# EAGLE design wachcio_meteo (EAGLE 7.7.0)

## Sheet 1 of 3: urzadzenie
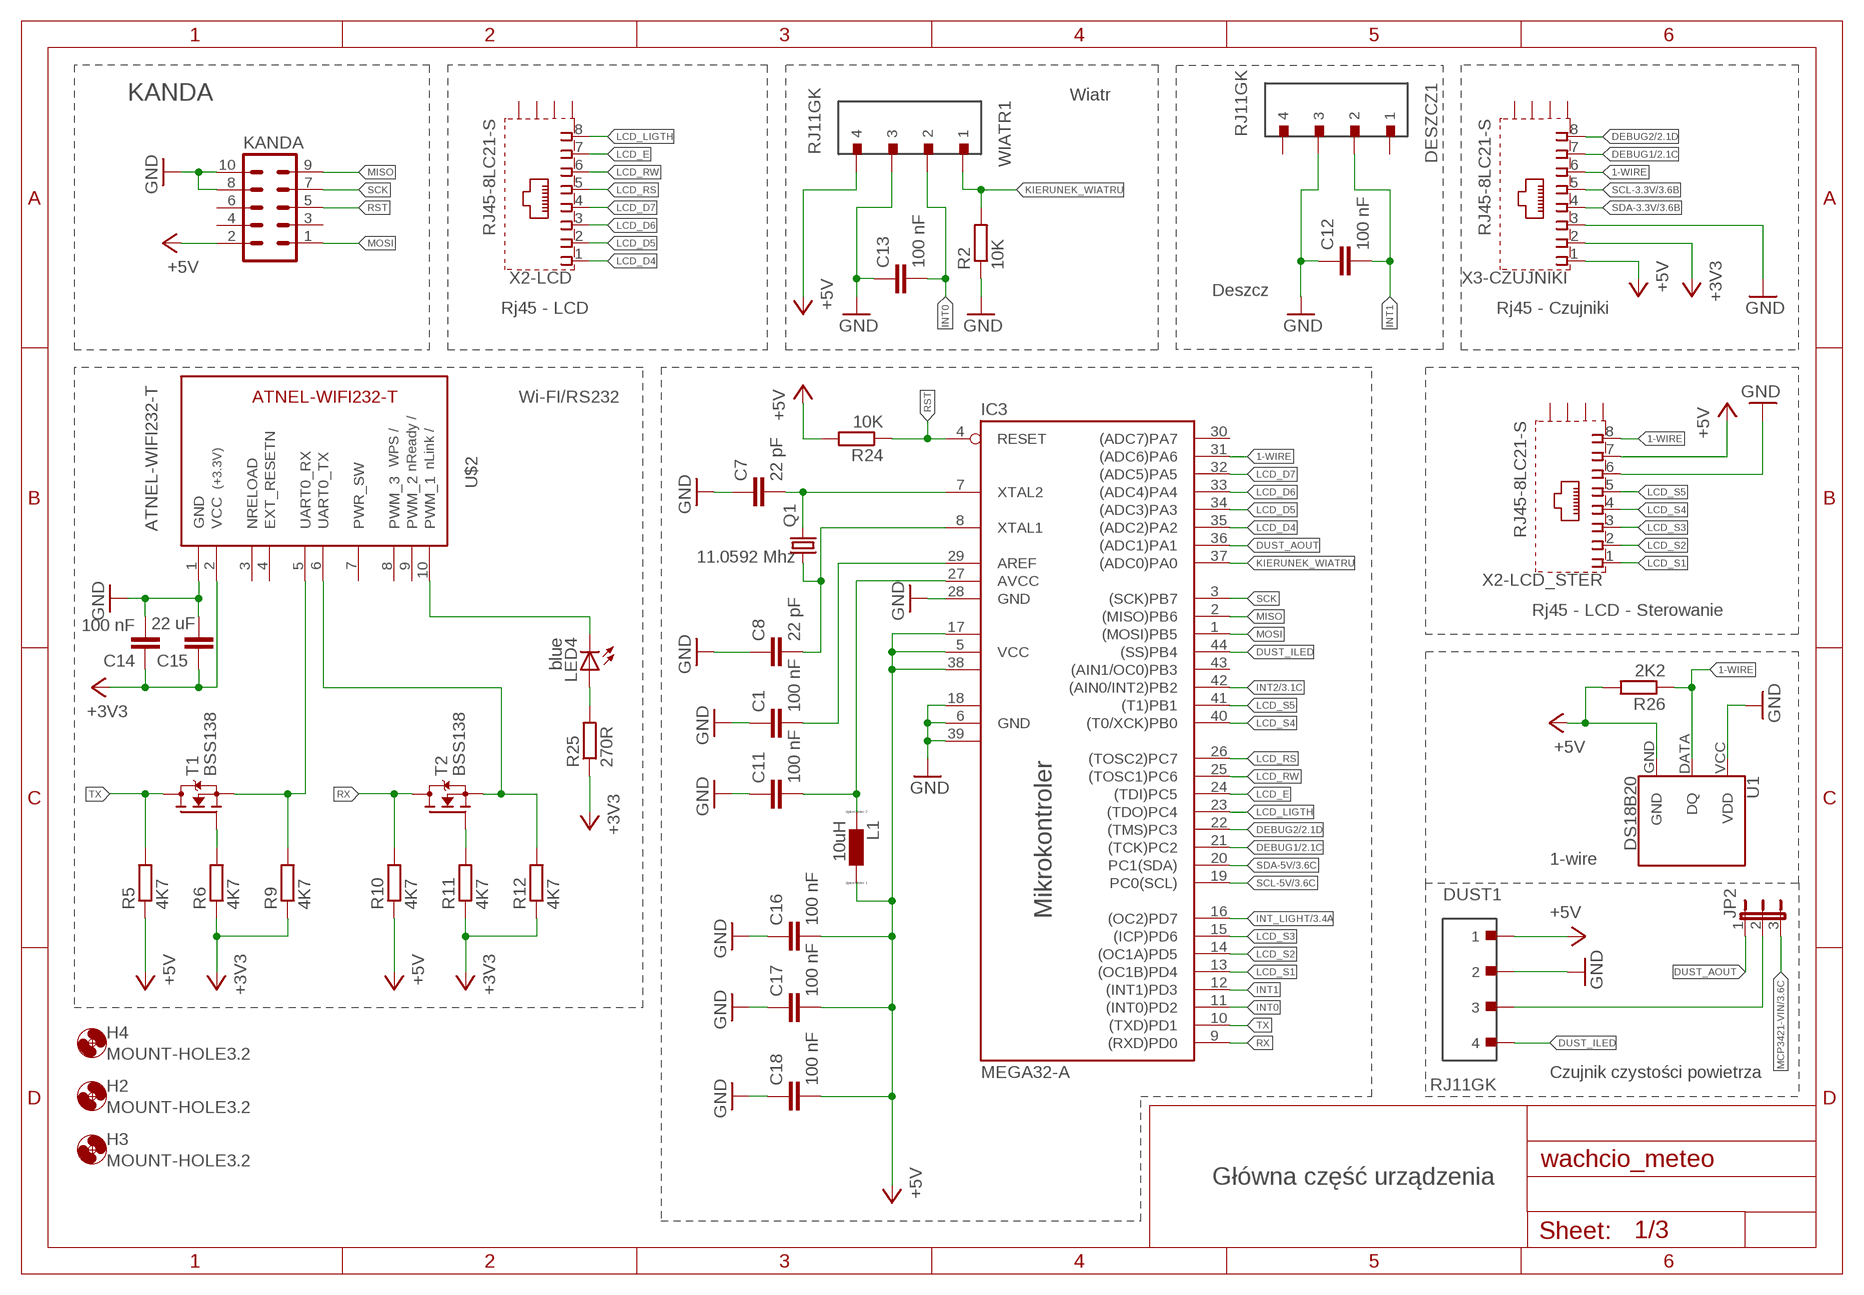
[diagram p0: schematic, sheet 1]

### Parts
C1  100 nF  C-EUC0805  [C0805]
C7  22 pF  C-EUC0805  [C0805]
C8  22 pF  C-EUC0805  [C0805]
C11  100 nF  C-EUC0805  [C0805]
C12  100 nF  C-EUC0805  [C0805]
C13  100 nF  C-EUC0805  [C0805]
C14  100 nF  C-EUC0805  [C0805]
C15  22 uF  C-EUC0805  [C0805]
C16  100 nF  C-EUC0805  [C0805]
C17  100 nF  C-EUC0805  [C0805]
C18  100 nF  C-EUC0805  [C0805]
DESZCZ1  RJ11GK  [RJ11GK]
DUST1  RJ11GK  [RJ11GK]
H2  MOUNT-HOLE3.2  [3,2]
H3  MOUNT-HOLE3.2  [3,2]
H4  MOUNT-HOLE3.2  [3,2]
IC3  MEGA32-A  [TQFP44]
JP2  JP2E  [JP2]
KANDA  ML10  [ML10]
L1  10uH  LL3230M  [L3230M]
LED4  blue  LEDCHIPLED_1206  [CHIPLED_1206]
Q1  11.0592 Mhz  CRYSTALSM49  [SM49]
R2  10K  R-EU_M0805  [M0805]
R5  4K7  R-EU_M0805  [M0805]
R6  4K7  R-EU_M0805  [M0805]
R9  4K7  R-EU_M0805  [M0805]
R10  4K7  R-EU_M0805  [M0805]
R11  4K7  R-EU_M0805  [M0805]
R12  4K7  R-EU_M0805  [M0805]
R24  10K  R-EU_M0805  [M0805]
R25  270R  R-EU_M0805  [M0805]
R26  2K2  R-EU_M0805  [M0805]
T1  BSS138  MOSFET-N-SOT23  [SOT23]
T2  BSS138  MOSFET-N-SOT23  [SOT23]
U1  DS18B20  [TO-92-AMMO]
U$2  ATNEL-WIFI232-T  [ATNEL-WIFI232-T]
WIATR1  RJ11GK  [RJ11GK]
X2-LCD  RJ45-8LC21-S  [RJ45-SHIELD1]
X2-LCD_STER  RJ45-8LC21-S  [RJ45-SHIELD1]
X3-CZUJNIKI  RJ45-8LC21-S  [RJ45-SHIELD1]

### Nets
1-WIRE: IC3.31((ADC6)PA6) R26.1 U1.DATA(DQ) X2-LCD_STER.8 X3-CZUJNIKI.6
+3V3: C14.1 C15.1 R6.1 R9.1 R11.1 R12.1 R25.1 U$2.2(VCC) X3-CZUJNIKI.2 ; also sheet 2,3
+5V: C16.2 C17.2 C18.2 DUST1.1 IC3.5(VCC) IC3.17(VCC1) IC3.38(VCC2) KANDA.2 L1.1 R5.1 R10.1 R24.2 R26.2 U1.GND WIATR1.4 X2-LCD_STER.7 X3-CZUJNIKI.1 ; also sheet 2,3
DEBUG1: IC3.21((TCK)PC2) X3-CZUJNIKI.7 ; also sheet 2
DEBUG2: IC3.22((TMS)PC3) X3-CZUJNIKI.8 ; also sheet 2
DUST_AOUT: IC3.36((ADC1)PA1) JP2.1
DUST_ILED: DUST1.4 IC3.44((SS)PB4)
GND: C1.1 C7.1 C8.1 C11.1 C12.1 C13.1 C14.2 C15.2 C16.1 C17.1 C18.1 DESZCZ1.3 DUST1.2 IC3.6(GND) IC3.18(GND1) IC3.28(GND) IC3.39(GND2) KANDA.8 KANDA.10 R2.1 U1.VCC(VDD) U$2.1(GND) WIATR1.3 X2-LCD_STER.6 X3-CZUJNIKI.3 ; also sheet 2,3
INT0: C13.2 IC3.11((INT0)PD2) WIATR1.2
INT1: C12.2 DESZCZ1.2 IC3.12((INT1)PD3)
INT2: IC3.42((AIN0/INT2)PB2) ; also sheet 3
INT_LIGHT: IC3.16((OC2)PD7) ; also sheet 3
KIERUNEK_WIATRU: IC3.37((ADC0)PA0) R2.2 WIATR1.1
LCD_D4: IC3.35((ADC2)PA2) X2-LCD.1
LCD_D5: IC3.34((ADC3)PA3) X2-LCD.2
LCD_D6: IC3.33((ADC4)PA4) X2-LCD.3
LCD_D7: IC3.32((ADC5)PA5) X2-LCD.4
LCD_E: IC3.24((TDI)PC5) X2-LCD.7
LCD_LIGTH: IC3.23((TDO)PC4) X2-LCD.8
LCD_RS: IC3.26((TOSC2)PC7) X2-LCD.5
LCD_RW: IC3.25((TOSC1)PC6) X2-LCD.6
LCD_S1: IC3.13((OC1B)PD4) X2-LCD_STER.1
LCD_S2: IC3.14((OC1A)PD5) X2-LCD_STER.2
LCD_S3: IC3.15((ICP)PD6) X2-LCD_STER.3
LCD_S4: IC3.40((T0/XCK)PB0) X2-LCD_STER.4
LCD_S5: IC3.41((T1)PB1) X2-LCD_STER.5
MCP3421-VIN: JP2.3 ; also sheet 3
MISO: IC3.2((MISO)PB6) KANDA.9
MOSI: IC3.1((MOSI)PB5) KANDA.1
N$1: R9.2 T1.2(S) U$2.5(UART0_RX)
N$2: C11.2 IC3.27(AVCC) L1.2
N$3: C1.2 IC3.29(AREF)
N$5: LED4.A R25.2
N$6: R6.2 T1.1(G)
N$8: LED4.C U$2.10(PWM_1)
N$9: R12.2 T2.2(S) U$2.6(UART0_TX)
N$10: C7.2 IC3.7(XTAL2) Q1.2
N$11: C8.2 IC3.8(XTAL1) Q1.1
N$16: DUST1.3 JP2.2
N$22: R11.2 T2.1(G)
RST: IC3.4(RESET) KANDA.5 R24.1
RX: IC3.9((RXD)PD0) R10.2 T2.3(D)
SCK: IC3.3((SCK)PB7) KANDA.7
SCL-3.3V: X3-CZUJNIKI.5 ; also sheet 3
SCL-5V: IC3.19(PC0(SCL)) ; also sheet 3
SDA-3.3V: X3-CZUJNIKI.4 ; also sheet 3
SDA-5V: IC3.20(PC1(SDA)) ; also sheet 3
TX: IC3.10((TXD)PD1) R5.2 T1.3(D)
Unconnected: DESZCZ1.1 DESZCZ1.4 IC3.30((ADC7)PA7) IC3.43((AIN1/OC0)PB3) KANDA.3 KANDA.4 KANDA.6 U$2.3(NRELOAD) U$2.4(EXT_RESETN) U$2.7(PWR_SW) U$2.8(PWM_3) U$2.9(PWM_2) X2-LCD.S1(S) X2-LCD.S2(S) X2-LCD.S3(S) X2-LCD.S4(S) X2-LCD_STER.S1(S) X2-LCD_STER.S2(S) X2-LCD_STER.S3(S) X2-LCD_STER.S4(S) X3-CZUJNIKI.S1(S) X3-CZUJNIKI.S2(S) X3-CZUJNIKI.S3(S) X3-CZUJNIKI.S4(S)

### Notes on the sheet
- KANDA | Wiatr
- Deszcz
- Rj45 - LCD | Rj45 - Czujniki
- Wi-FI/RS232
- Rj45 - LCD - Sterowanie
- 1-wire
- Mikrokontroler
- Czujnik czystości powietrza
- Główna część urządzenia

## Sheet 2 of 3: zasilanie
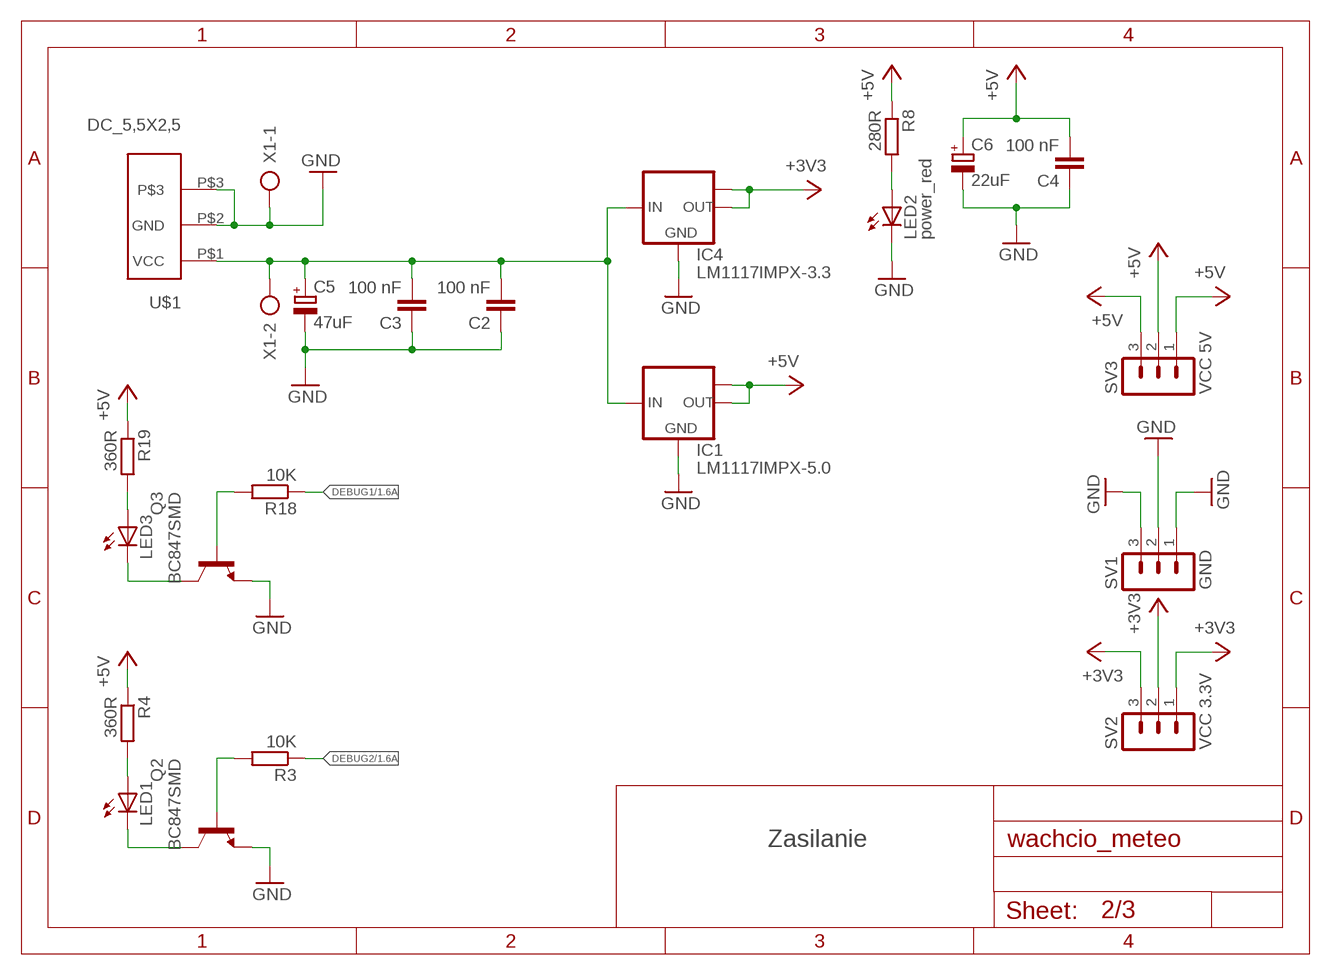
[diagram p1: schematic, sheet 2]

### Parts
C2  100 nF  C-EUC0805  [C0805]
C3  100 nF  C-EUC0805  [C0805]
C4  100 nF  C-EUC0805  [C0805]
C5  47uF  CPOL-EUB45181A  [B45181A]
C6  22uF  CPOL-EUB45181A  [B45181A]
IC1  LM1117IMPX-5.0  [SOT223]
IC4  LM1117IMPX-3.3  [SOT223]
LED1  LED3MM  [LED3MM]
LED2  power_red  LEDCHIPLED_1206  [CHIPLED_1206]
LED3  LED3MM  [LED3MM]
Q2  BC847SMD  [SOT23]
Q3  BC847SMD  [SOT23]
R3  10K  R-EU_M0805  [M0805]
R4  360R  R-EU_M0805  [M0805]
R8  280R  R-EU_M0805  [M0805]
R18  10K  R-EU_M0805  [M0805]
R19  360R  R-EU_M0805  [M0805]
SV1  GND  MA03-1  [MA03-1]
SV2  VCC 3.3V  MA03-1  [MA03-1]
SV3  VCC 5V  MA03-1  [MA03-1]
U$1  DC_5,5X2,5  [DC_5,5X2,5]
X1  AK500/2  [AK500/2]

### Nets
+3V3: IC4.2(OUT) IC4.TAB(OUT1) SV2.1 SV2.2 SV2.3 ; also sheet 1,3
+5V: C4.2 C6.+ IC1.2(OUT) IC1.TAB(OUT1) R4.1 R8.1 R19.1 SV3.1 SV3.2 SV3.3 ; also sheet 1,3
+9V: C2.2 C3.2 C5.+ IC1.3(IN) IC4.3(IN) U$1.P$1(VCC) X1.2
DEBUG1: R18.1 ; also sheet 1
DEBUG2: R3.1 ; also sheet 1
GND: C2.1 C3.1 C4.1 C5.- C6.- IC1.1(GND) IC4.1(GND) LED2.C Q2.2(E) Q3.2(E) SV1.1 SV1.2 SV1.3 U$1.P$2(GND) U$1.P$3 X1.1 ; also sheet 1,3
N$4: Q2.1(B) R3.2
N$12: LED2.A R8.2
N$17: LED1.K(C) Q2.3(C)
N$21: LED1.A R4.2
N$23: Q3.1(B) R18.2
N$24: LED3.K(C) Q3.3(C)
N$26: LED3.A R19.2

### Notes on the sheet
- Zasilanie

## Sheet 3 of 3: I2C
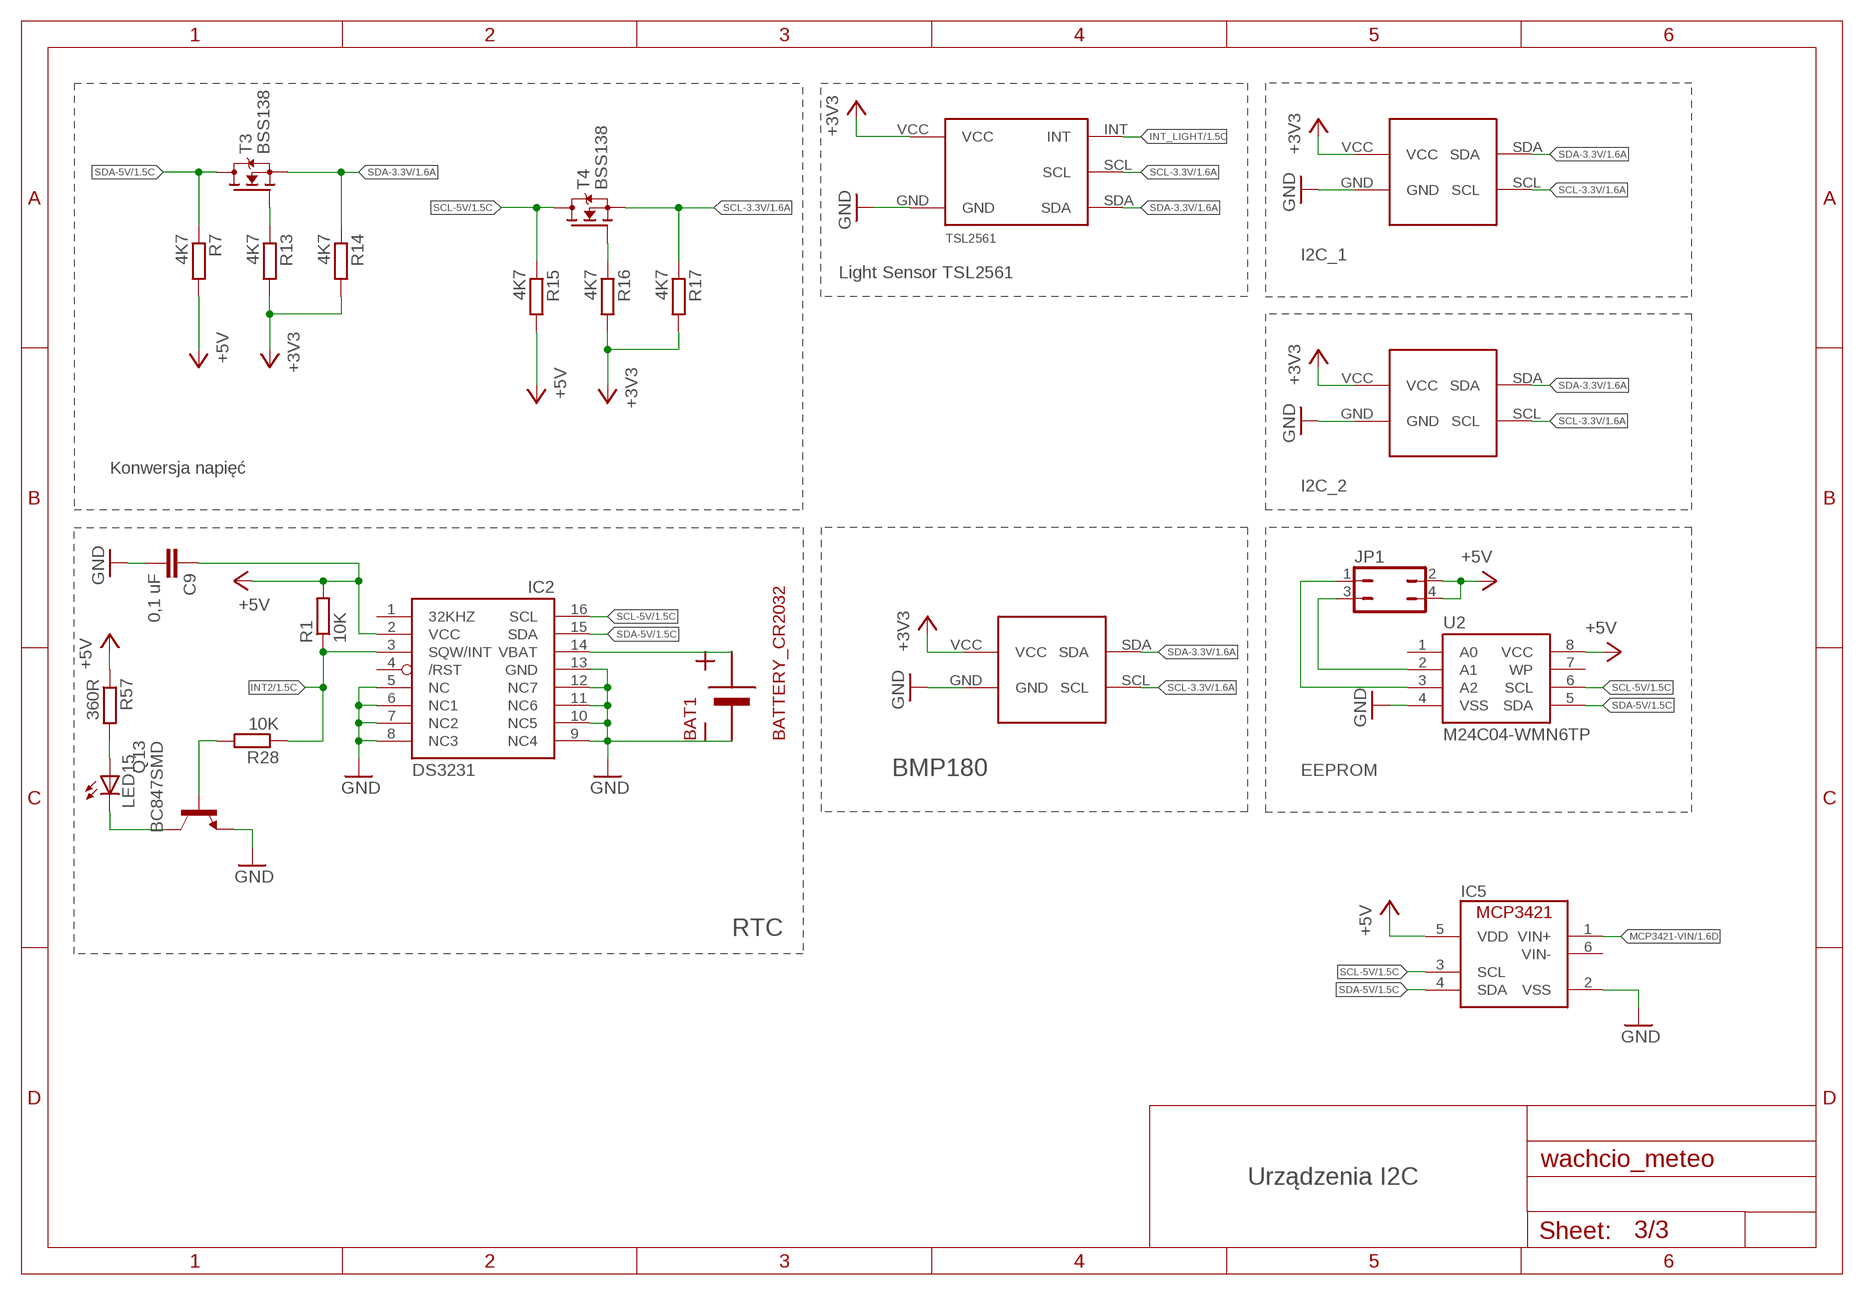
[diagram p2: schematic, sheet 3]

### Parts
BAT1  BATTERY_CR2032  [BATTERY_CR2032]
C9  0,1 uF  C-EUC0805  [C0805]
IC2  DS3231/SO  [SO16W]
IC5  MCP3421  [SOT-23]
JP1  JP2Q  [JP2Q]
LED15  LED3MM  [LED3MM]
Q13  BC847SMD  [SOT23]
R1  10K  R-EU_M0805  [M0805]
R7  4K7  R-EU_M0805  [M0805]
R13  4K7  R-EU_M0805  [M0805]
R14  4K7  R-EU_M0805  [M0805]
R15  4K7  R-EU_M0805  [M0805]
R16  4K7  R-EU_M0805  [M0805]
R17  4K7  R-EU_M0805  [M0805]
R28  10K  R-EU_M0805  [M0805]
R57  360R  R-EU_M0805  [M0805]
T3  BSS138  MOSFET-N-SOT23  [SOT23]
T4  BSS138  MOSFET-N-SOT23  [SOT23]
U2  M24C04-WMN6TP  EEPROM-I2CSMD  [SO08]
U$3  BMP180  [BMP180]
U$5  I2C_BOARD  [I2C_BOARD]
U$6  I2C_BOARD  [I2C_BOARD]
U$7  TSL2561GY-2561  [TSL2561]

### Nets
+3V3: R13.2 R14.2 R16.2 R17.2 U$3.VCC U$5.VCC U$6.VCC U$7.VCC ; also sheet 1,2
+5V: C9.1 IC2.2(VCC) IC5.5(VDD) JP1.2 JP1.4 R1.2 R7.2 R15.2 R57.1 U2.8(VCC) ; also sheet 1,2
GND: BAT1.- C9.2 IC2.5(NC) IC2.6(NC1) IC2.7(NC2) IC2.8(NC3) IC2.9(NC4) IC2.10(NC5) IC2.11(NC6) IC2.12(NC7) IC2.13(GND) IC5.2(VSS) Q13.2(E) U2.4(VSS) U$3.GND U$5.GND U$6.GND U$7.GND ; also sheet 1,2
INT2: IC2.3(SQW/INT) R1.1 R28.1 ; also sheet 1
INT_LIGHT: U$7.INT ; also sheet 1
MCP3421-VIN: IC5.1(VIN+) ; also sheet 1
N$7: BAT1.+ IC2.14(VBAT)
N$25: R13.1 T3.1(G)
N$27: R16.1 T4.1(G)
N$32: JP1.3 U2.2(A1)
N$33: JP1.1 U2.3(A2)
N$37: Q13.1(B) R28.2
N$45: LED15.K(C) Q13.3(C)
N$75: LED15.A R57.2
SCL-3.3V: R17.1 T4.2(S) U$3.SCL U$5.SCL U$6.SCL U$7.SCL ; also sheet 1
SCL-5V: IC2.16(SCL) IC5.3(SCL) R15.1 T4.3(D) U2.6(SCL) ; also sheet 1
SDA-3.3V: R14.1 T3.2(S) U$3.SDA U$5.SDA U$6.SDA U$7.SDA ; also sheet 1
SDA-5V: IC2.15(SDA) IC5.4(SDA) R7.1 T3.3(D) U2.5(SDA) ; also sheet 1
Unconnected: IC2.1(32KHZ) IC2.4(/RST) IC5.6(VIN-) U2.1(A0) U2.7(WP)

### Notes on the sheet
- I2C_1
- Light Sensor TSL2561
- Konwersja napięć
- I2C_2
- BMP180 | EEPROM
- RTC
- Urządzenia I2C

## Library data of the parts
BAT1 = wachcio:BATTERY_CR2032
C1-C4 C7-C9 C11-C18 = rcl:C-EU: CAPACITOR, European symbol
C5 C6 = rcl:CPOL-EU: POLARIZED CAPACITOR, European symbol
DESZCZ1 DUST1 WIATR1 = wachcio:RJ11GK
H2-H4 = holes:MOUNT-HOLE: MOUNTING HOLE with drill center marker
IC1 IC4 = lm1117:LM1117IMPX-*
IC2 = adafruit:DS3231
IC3 = atmel:MEGA32: MICROCONTROLLER 32 Kbytes FLASH 2 Kbytes SRAM 1 Kbytes EEPROM USART 8-channel 10 bit ADC Source: www.atmel.com .. doc2503.pdf; MPN: ATMEGA32-16AU; OC_FARNELL: 9171274; OC_NEWARK: 69K6677
IC5 = FaBo-Sensor:MCP3421
JP1 = jumper:JP2Q: JUMPER
JP2 = jumper:JP2E: JUMPER
KANDA = con-harting-ml:ML10: HARTING; OC_FARNELL: unknown; OC_NEWARK: unknown
L1 = eagle-ltspice:L: INDUCTOR, European symbol; SPICEMODEL: NONE; SPICEPREFIX: L
LED1-LED4 LED15 = adafruit:LED: LED OSRAM: - CHIPLED LG R971, LG N971, LY N971, LG Q971, LY Q971, LO R971, LY R971 LH N974, LH R974 LS Q976, LO Q976, LY Q976 LO Q996 - Hyper CHIPLED LW Q18S LB Q993, LB Q99A, LB R99A - SideLED LS A670, LO A670, LY A670, LG A670, LP A670 LB A673, LV A673, LT A673, LW A673 LH A674 LY A675 LS A676, LA A676, LO A676, LY A676, LW A676 LS A679, LY A679, LG A679 - Hyper Micro SIDELED® LS Y876, LA Y876, LO Y876, LY Y876 LT Y87S - SmartLED LW L88C, LW L88S LB L89C, LB L89S, LG L890 LS L89K, LO L89K, LY L89K LS L896, LA L896, LO L896, LY L896 - TOPLED LS T670, LO T670, LY T670, LG T670, LP T670 LSG T670, LSP T670, LSY T670, LOP T670, LYG T670 LG T671, LOG T671, LSG T671 LB T673, LV T673, LT T673, LW T673 LH T674 LS T676, LA T676, LO T676, LY T676, LB T676, LH T676, LSB T676, LW T676 LB T67C, LV T67C, LT T67C, LS T67K, LO T67K, LY T67K, LW E67C LS E67B, LA E67B, LO E67B, LY E67B, LB E67C, LV E67C, LT E67C LW T67C LS T679, LY T679, LG T679 LS T770, LO T770, LY T770, LG T770, LP T770 LB T773, LV T773, LT T773, LW T773 LH T774 LS E675, LA E675, LY E675, LS T675 LS T776, LA T776, LO T776, LY T776, LB T776 LHGB T686 LT T68C, LB T68C - Hyper Mini TOPLED® LB M676 - Mini TOPLED Santana® LG M470 LS M47K, LO M47K, LY M47K Source: http://www.osram.convergy.de/
Q1 = adafruit:CRYSTAL: CRYSTAL; OC_FARNELL: unknown; OC_NEWARK: unknown
Q2 Q3 Q13 = transistor-npn:BC847*: NPN Transistor
R1-R19 R24-R26 R28 R57 = rcl:R-EU_: RESISTOR, European symbol
SV1-SV3 = con-lstb:MA03-1: PIN HEADER; OC_FARNELL: unknown; OC_NEWARK: unknown
T1-T4 = we-transistor:MOSFET-N: N-Channel MOSFET SOT23 N-Chn MOSFET TSM3404, IRLML2502 (Vgs>=+/-20V, Vds<=20V, Id>=3A + Rds<=0.05Ohm @ Vgs=4.5V) BSS138 (Vgs>=+/-20V, Vds<=40V, Id>=0.2A + Rds<=3Ohm @ Vgs=4.5V) SOT223 Low Side Switch with Protection (Infineon) BSP76 (Vin=0...10V, Vds<=42V, Id=1.4A + Rds=0.2Ohm @ Vin=5V) BSP77 (Vin=0...10V, Vds<=42V, Id=2.2A + Rds=0.1Ohm @ Vin=5V) D²Pak Low Side Switch with Protection (Infineon) BTS117TC (Vin=0...10V, Vds<=60V, Id=3.5A + Rds=0.12Ohm @ Vin=5V) BTS133TC (Vin=0...10V, Vds<=60V, Id=7A + Rds=0.06Ohm @ Vin=5V) BTS141TC (Vin=0...10V, Vds<=60V, Id=12A + Rds=0.03Ohm @ Vin=5V) BTS3018TC (Vin=0...10V, Vds<=60V, Id=6A + Rds=0.02Ohm @ Vin=5V)
U1 = SparkFun-Sensors:DS18B20: Dallas/Maxim DS18B20 1-Wire Temperature Sensor The DS18B20 reports degrees C with 9 to 12-bit precision, -55C to 125C (+/-0.5C). Each sensor has a unique 64-Bit Serial number etched into it - allows for a huge number of sensors to be used on one data bus. Datasheet <http://datasheets.maximintegrated.com/en/ds/DS18B20.pdf> SparkFun Products One Wire Digital Temperature Sensor - DS18B20 <https://www.sparkfun.com/products/245> (SEN-00245); STORE_ID: SEN-00245
U2 = SparkFun-IC-Memory:EEPROM-I2C: I2C EEPROMs, 24LC256 and others 24LC256 Series 256 kb I2C 2 Wire (32 k x 8 Bit) 2.5 V Serial EEPROM SMD - SOIC-8 Datasheet SparkFun Products SparkFun UDB5 - PIC UAV Development Board <https://www.sparkfun.com/products/11703> (GPS-11703); PROD_ID: IC-09714; VALUE: 24LC256
U$1 = wachcio:DC_5,5X2,5
U$2 = ATNEL-WIFI232-T:ATNEL-WIFI232-T
U$3 = boards:BMP180
U$5 U$6 = boards2:I2C_BOARD
U$7 = wachcio:TSL2561
X1 = con-ptr500:AK500/2: CONNECTOR; OC_FARNELL: unknown; OC_NEWARK: unknown
X2-LCD X2-LCD_STER X3-CZUJNIKI = con-tycoelectronics:RJ45*2: RJ45 Low Profile Shield Type 2 For all RJ45 L, LC, LCT and X Series Models Source: www.tycoelectronics.com .. ENG_DS_1654001_1099_RJ_L_0507.pdf; OC_FARNELL: unknown; OC_NEWARK: unknown

## Board
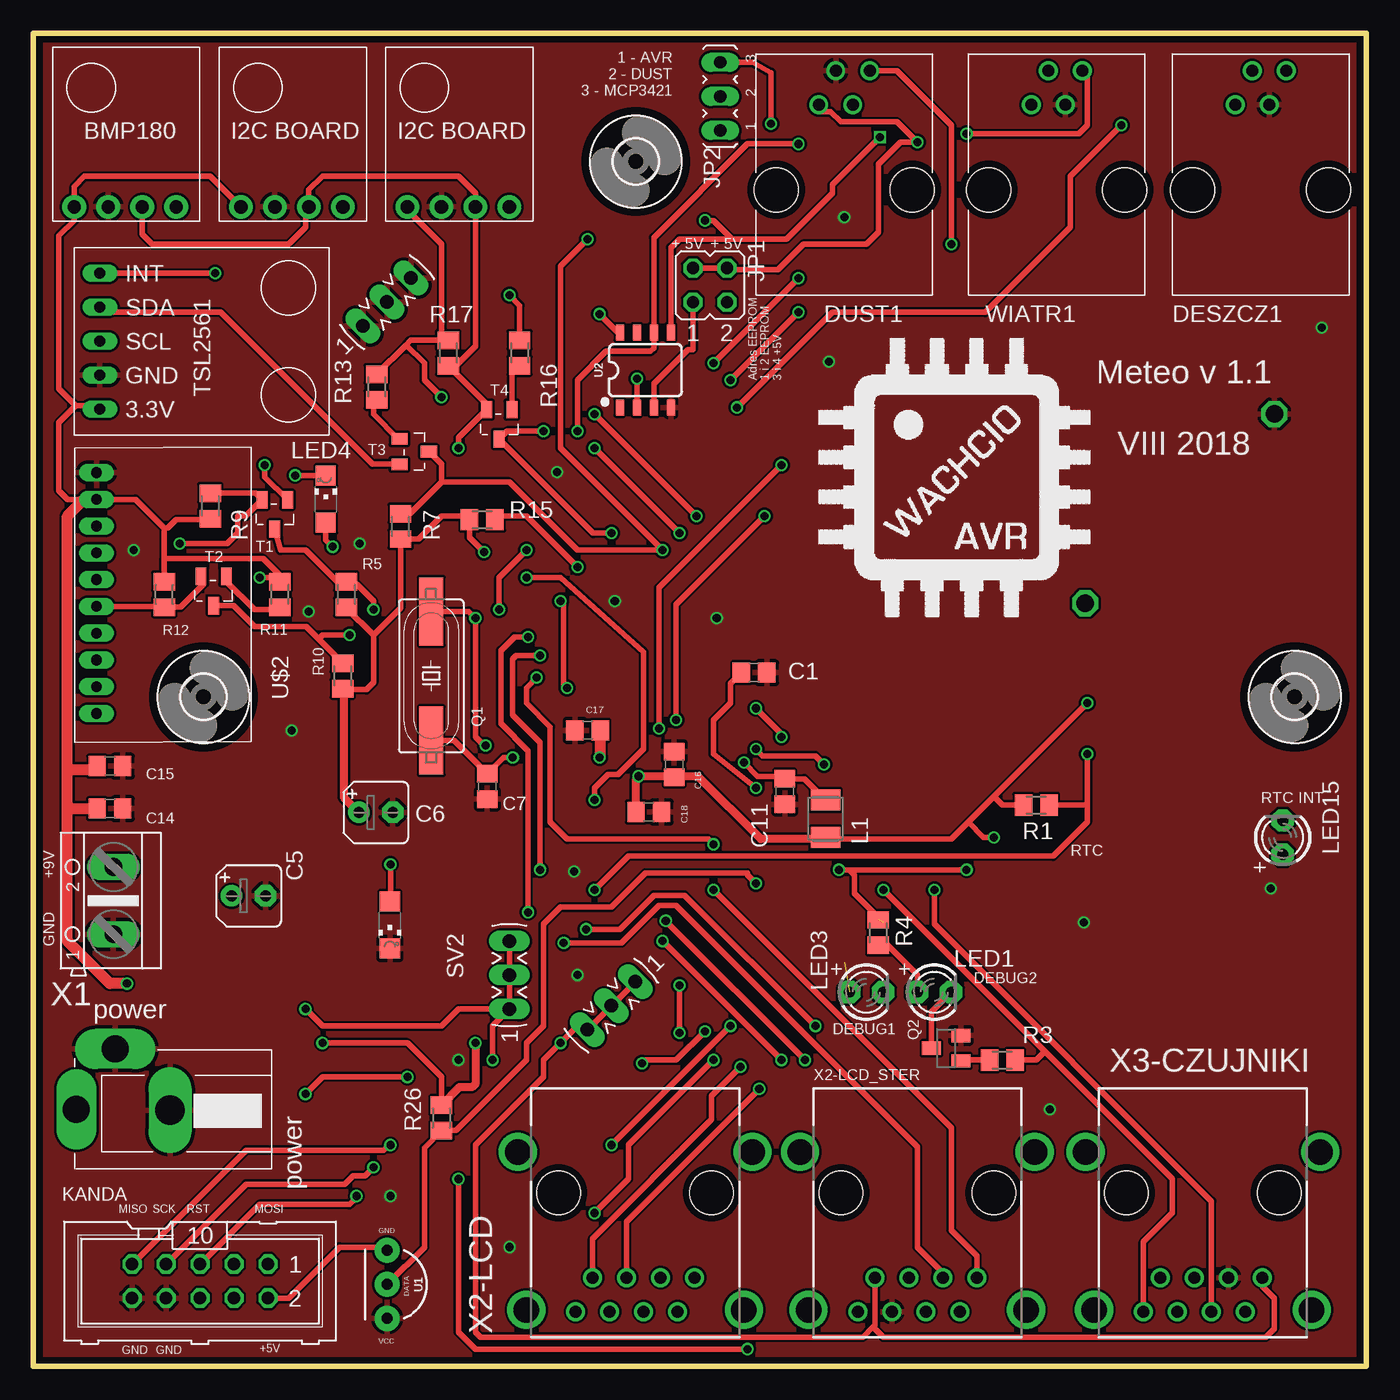
[diagram p3: board, top side]
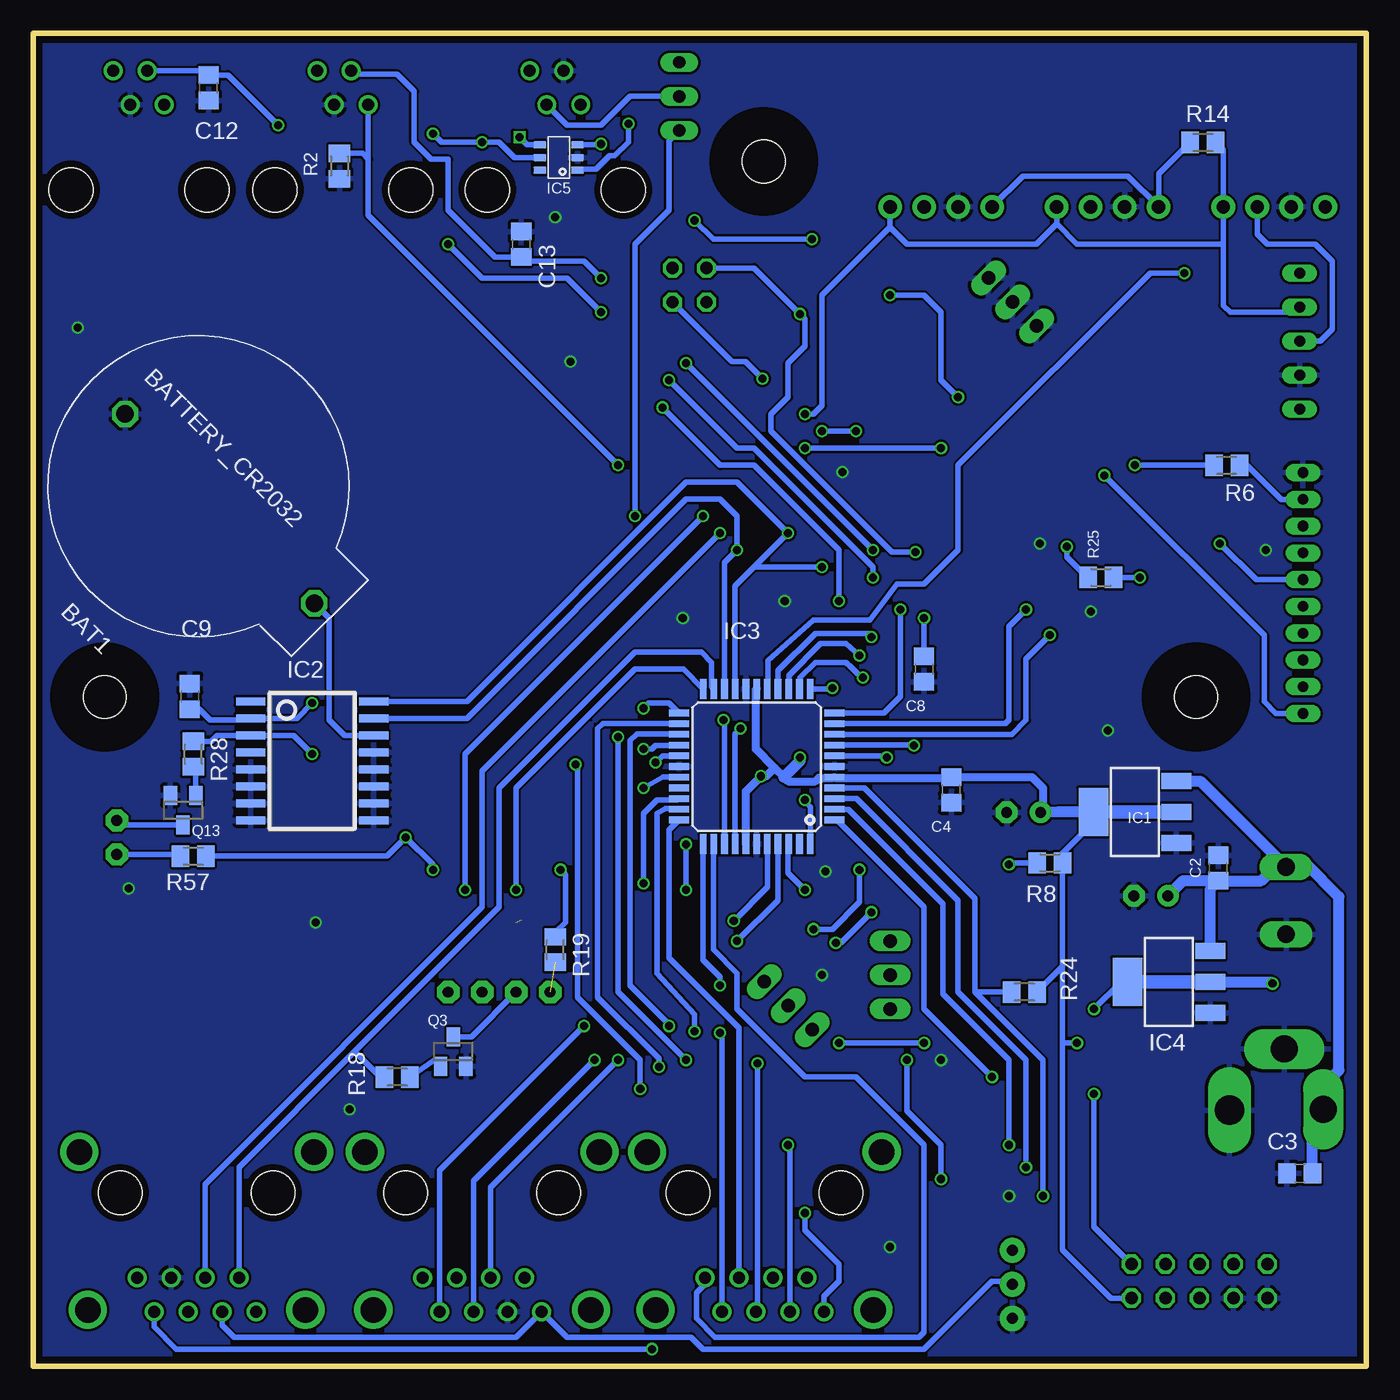
[diagram p4: board, bottom side, seen from below]

Size 99.57 x 99.57 mm. Coordinates in mm from the lower left corner, seen from the top.
Outline: 0,0 99.57,0 99.57,99.57 0,99.57 0,0
Copper layers (1*16): Top 0.035mm / dielectric 1.5mm / Bottom 0.035mm
Design rules "smart-prototyping *": minimum track width 7mil, minimum drill 12mil, track to track 7mil, track to pad 7mil, pad to pad 7mil, via to via 7mil, smd to smd 0mil, copper to edge 20mil, drill to drill 10mil, minimum pad ring 10mil, minimum via ring 6mil, stop-mask expansion 2mil, vias tented up to drill 0mil, thermal gap 10mil

### Footprints (pad centres in the part's own frame; a part is rotated, then mirrored left to right if it is on the bottom)
BATTERY_CR2032 = drill 1.3 octagon: + -11,0; - 9,0
C0805 = smd 1.3 x 1.5: 1 -0.95,0; 2 0.95,0
B45181A = drill 0.813 pad 1.6: + -1.27,0 | drill 0.813 pad 1.6 octagon: - 1.27,0
RJ11GK = drill 0.9: 1 -1.65,5.34; 2 -0.38,7.88; 3 0.89,5.34; 4 2.16,7.88 | hole 3.3: -4.83,-1.01; 5.33,-1.01
3,2 = hole 3.2: 0,0
SOT223 = smd 1.219 x 2.235: 1 -2.311,-3.099; 2 0,-3.099; 3 2.311,-3.099 | smd 3.6 x 2.2: TAB 0,3.099
SO16W = smd 0.6 x 2.2: 1 -4.445,-4.6; 2 -3.175,-4.6; 3 -1.905,-4.6; 4 -0.635,-4.6; 5 0.635,-4.6; 6 1.905,-4.6; 7 3.175,-4.6; 8 4.445,-4.6; 9 4.445,4.6; 10 3.175,4.6; 11 1.905,4.6; 12 0.635,4.6; 13 -0.635,4.6; 14 -1.905,4.6; 15 -3.175,4.6; 16 -4.445,4.6
TQFP44 = smd 1.5 x 0.5: 1 -5.8,4; 2 -5.8,3.2; 3 -5.8,2.4; 4 -5.8,1.6; 5 -5.8,0.8; 6 -5.8,0; 7 -5.8,-0.8; 8 -5.8,-1.6; 9 -5.8,-2.4; 10 -5.8,-3.2; 11 -5.8,-4; 23 5.8,-4; 24 5.8,-3.2; 25 5.8,-2.4; 26 5.8,-1.6; 27 5.8,-0.8; 28 5.8,0; 29 5.8,0.8; 30 5.8,1.6; 31 5.8,2.4; 32 5.8,3.2; 33 5.8,4 | smd 0.5 x 1.5: 12 -4,-5.8; 13 -3.2,-5.8; 14 -2.4,-5.8; 15 -1.6,-5.8; 16 -0.8,-5.8; 17 0,-5.8; 18 0.8,-5.8; 19 1.6,-5.8; 20 2.4,-5.8; 21 3.2,-5.8; 22 4,-5.8; 34 4,5.8; 35 3.2,5.8; 36 2.4,5.8; 37 1.6,5.8; 38 0.8,5.8; 39 0,5.8; 40 -0.8,5.8; 41 -1.6,5.8; 42 -2.4,5.8; 43 -3.2,5.8; 44 -4,5.8
SOT-23 = smd 1 x 0.55: 1 -1.4,0.95; 2 -1.4,0; 3 -1.4,-0.95; 4 1.4,-0.95; 5 1.4,0; 6 1.4,0.95
JP2Q = drill 0.914 octagon: 1 -1.27,-1.27; 2 -1.27,1.27; 3 1.27,-1.27; 4 1.27,1.27
JP2 = drill 0.914 long: 1 -2.54,0; 2 0,0; 3 2.54,0
ML10 = drill 0.914 octagon: 1 -5.08,-1.27; 2 -5.08,1.27; 3 -2.54,-1.27; 4 -2.54,1.27; 5 0,-1.27; 6 0,1.27; 7 2.54,-1.27; 8 2.54,1.27; 9 5.08,-1.27; 10 5.08,1.27
L3230M = smd 1.6 x 2.2: 1 -1.4,0; 2 1.4,0
LED3MM = drill 0.813 pad 1.676 octagon: A -1.27,0; K 1.27,0
CHIPLED_1206 = smd 1.5 x 1.5: A 0,-1.75; C 0,1.75
SM49 = smd 5.08 x 1.778: 1 -4.826,0; 2 4.826,0
SOT23 = smd 1 x 1.4: 1 -0.95,-1.1; 2 0.95,-1.1; 3 0,1.1
M0805 = smd 1.3 x 1.6: 1 -0.95,0; 2 0.95,0
MA03-1 = drill 1.016 long: 1 -2.54,0; 2 0,0; 3 2.54,0
SOT23' = smd 1.3 x 0.9: 1 -1.1,0.95; 2 -1.1,-0.95; 3 1.1,0
TO-92-AMMO = drill 0.813 pad 1.88: DATA 0,0; GND -2.54,0; VCC 2.54,0
SO08 = smd 0.6 x 1.2: 1 -1.905,-2.8; 2 -0.635,-2.8; 3 0.635,-2.8; 4 1.905,-2.8; 5 1.905,2.8; 6 0.635,2.8; 7 -0.635,2.8; 8 -1.905,2.8
DC_5,5X2,5 = drill 2 long: P$1 14.605,4.445; P$2 11.7,-0.07 | drill 2.2 long: P$3 7.6,4.5
ATNEL-WIFI232-T = drill 0.8 pad 1.27 long: 1 -9.1,-5.45; 2 -7.1,-5.45; 3 -5.1,-5.45; 4 -3.1,-5.45; 5 -1.1,-5.45; 6 0.9,-5.45; 7 2.9,-5.45; 8 4.9,-5.45; 9 6.9,-5.45; 10 8.9,-5.45
BMP180 = drill 1 pad 1.778: GND 1.27,5.08; SCL -1.27,5.08; SDA -3.81,5.08; VCC 3.81,5.08
I2C_BOARD = drill 1 pad 1.778: GND 1.27,5.08; SCL -1.27,5.08; SDA -3.81,5.08; VCC 3.81,5.08
TSL2561 = drill 0.8 long: GND 3.175,-8.255; INT -4.445,-8.255; SCL 0.635,-8.255; SDA -1.905,-8.255; VCC 5.715,-8.255
AK500/2 = drill 1.321 long: 1 -2.515,0; 2 2.515,0
RJ45-SHIELD1 = drill 0.9 pad 1.4: 1 -4.445,6.35; 2 -3.175,8.89; 3 -1.905,6.35; 4 -0.635,8.89; 5 0.635,6.35; 6 1.905,8.89; 7 3.175,6.35; 8 4.445,8.89 | drill 1.9 pad 2.5: S1 -8.763,-3.048; S2 8.763,-3.048; S3 -8.128,8.76; S4 8.128,8.76 | hole 3.251: -5.715,0; 5.715,0

### Placement (x,y rotation side)
BAT1  86.36,64.77 135 bottom
C1  53.85,51.82 180 top
C2  11.05,37.21 270 bottom
C3  4.95,14.4 0 bottom
C4  30.99,43.05 90 bottom
C5  16.08,35.13 0 top
C6  25.58,41.37 0 top
C7  33.91,43.31 90 top
C8  33.02,52.07 90 bottom
C9  87.88,50.04 90 bottom
C11  56.13,42.93 90 top
C12  86.49,95.5 90 bottom
C13  63.12,83.82 270 bottom
C14  5.71,41.66 0 top
C15  5.71,44.83 0 top
C16  47.88,44.96 270 top
C17  41.4,47.5 0 top
C18  45.97,41.4 180 top
DESZCZ1  91.44,88.9 0 top
DUST1  60.33,88.9 0 top
H2  45,90 0 top
H3  94.23,50 0 top
H4  12.7,50 0 top
IC1  17.27,41.4 90 bottom
IC2  78.74,45.21 270 bottom
IC3  45.53,44.8 180 bottom
IC4  14.73,28.7 90 bottom
IC5  60.33,90.3 180 bottom
JP1  50.55,80.77 0 top
JP2  51.31,94.87 90 top
KANDA  12.45,6.35 180 top
L1  59.18,40.89 90 top
LED1  67.31,27.94 0 top
LED2  26.63,32.95 180 top
LED3  62.23,27.94 0 top
LED4  21.84,64.77 0 top
LED15  93.34,39.5 90 top
Q1  29.72,51.56 270 top
Q2  68.2,23.75 90 top
Q3  68.2,23.5 0 bottom
Q13  88.39,41.53 180 bottom
R1  74.93,41.91 180 top
R2  76.71,89.66 90 bottom
R3  72.39,22.86 180 top
R4  63.12,32.38 270 top
R5  23.37,57.66 90 top
R6  10.41,67.31 180 bottom
R7  27.43,62.74 270 top
R8  23.62,37.59 180 bottom
R9  13.21,64.26 90 top
R10  23.11,51.56 90 top
R11  18.41,57.66 270 top
R12  9.78,57.66 270 top
R13  25.65,73.15 90 top
R14  12.19,91.44 180 bottom
R15  33.53,63.25 180 top
R16  36.32,75.69 90 top
R17  30.99,75.69 90 top
R18  72.39,21.59 0 bottom
R19  60.58,31.11 270 bottom
R24  25.53,27.94 0 bottom
R25  19.81,58.93 180 bottom
R26  30.48,18.54 90 top
R28  87.63,45.72 270 bottom
R57  87.63,38.1 180 bottom
SV1  26.42,79.5 45 top
SV2  35.56,29.21 90 top
SV3  43.18,26.92 225 top
T1  BSS138  [SOT23']  18.03,63.63 270 top
T2  BSS138  [SOT23']  13.46,57.91 270 top
T3  BSS138  [SOT23']  28.45,68.33 0 top
T4  BSS138  [SOT23']  34.8,70.36 270 top
U1  26.42,6.1 270 top
U2  45.72,74.42 0 top
U$1  17.81,23.62 180 top
U$2  10.16,57.66 270 top
U$3  6.86,91.69 180 top
U$5  19.3,91.69 180 top
U$6  31.75,91.69 180 top
U$7  13.21,77.22 270 top
U$8  [LOGO]  70.87,65.66 0 top
WIATR1  76.2,88.9 0 top
X1  5.97,34.78 90 top
X2-LCD  44.96,12.95 180 top
X2-LCD_STER  66.04,12.95 180 top
X3-CZUJNIKI  87.38,12.95 180 top

### Tracks (layer width: path | path; a pad name or v marks a point on that pad's centre or on a via)
1-WIRE  (via drill 0.6)
  Top 0.406: U1.DATA 29.21,8.89 29.21,16.32 R26.1 31.56,17.59 36.83,22.86 36.83,24.13 38.1,25.4 38.1,33.02 39.37,34.29 43.18,34.29 45.72,36.83 53.34,36.83 53.34,36.7 v53.98,36.07
  Bottom 0.406: U1.DATA 26.67,6.35 27.94,6.35 33.02,1.27 49.53,1.27 50.42,2.16 59.69,2.16 X2-LCD_STER.8 63.5,2.16 84.58,2.16 85.47,3.05 X3-CZUJNIKI.6 | v53.98,36.07 53.98,41.27 52.96,42.29 51.44,42.29 IC3.31
+3V3  (via drill 0.6)
  Top 0.406: 3.17,71.75 1.91,70.48 1.91,65.41 2.55,64.76 U$2.2 7.63,64.76 9.78,62.61 | 3.17,71.75 4.7,71.75 U$7.VCC | 3.17,71.75 1.91,73.03 1.91,84.45 3.05,85.6 U$3.VCC 3.05,88.14 3.81,88.9 13.21,88.9 U$5.VCC | R12.1 9.78,60.33 | 9.78,60.33 17.14,60.33 18.41,59.05 R11.1 18.09,58.93 v16.89,58.93 | v20.32,26.67 21.59,25.4 30.48,25.4 31.75,26.67 SV2.1 | SV2.1 SV2.2 SV2.3 | v53.34,1.27 33.02,1.27 31.75,2.54 v31.75,13.97 | v34.29,22.86 34.29,25.4 SV2.1 | 27.85,76.29 28.19,76.64 R17.2 30.48,77.15 30.48,83.82 27.94,86.36 U$6.VCC | 27.85,76.29 R13.2 | R16.2 36.32,79.25 v35.56,80.01 | v30.48,72.39 29.21,73.66 29.21,74.93 27.85,76.29 | 9.78,62.61 9.78,60.33 | 9.78,62.61 10.03,62.61 10.67,63.25 13.14,63.25 R9.1
  Top 0.813: v6.99,28.57 5.71,28.57 2.54,31.75 2.54,41.91 | 2.54,41.91 2.54,44.45 | 2.54,44.45 2.54,63.5 3.81,64.77 4.7,64.77 U$2.2 | 2.54,41.91 2.79,41.66 C14.1 | 2.54,44.45 2.67,44.58 4.51,44.58 C15.1
  Bottom 0.406: R25.1 v16.89,58.93 | IC4.TAB 18.29,28.7 v20.32,26.67 | X3-CZUJNIKI.2 90.55,2.92 88.9,1.27 v53.34,1.27 | v31.75,13.97 31.75,16.51 34.29,19.05 v34.29,22.86 | U$6.VCC 25.65,88.9 17.78,88.9 U$5.VCC 15.49,89.09 R14.2 | v35.56,80.01 33.02,80.01 31.75,78.74 31.75,73.66 v30.48,72.39 | R6.1 8.9,67.31 6.35,64.76 U$2.2
  Bottom 0.813: IC4.2 7.11,28.7 v6.99,28.57
  Bottom 1.016: IC4.2 IC4.TAB
+5V  (via drill 0.6)  (1 unrouted)
  Top 0.406: KANDA.2 19.05,5.08 22.86,8.89 26.16,8.89 U1.GND | R5.1 23.37,56.64 25.4,54.61 | 25.4,54.61 25.4,51.05 24.89,50.55 23.18,50.55 R10.1 | R26.2 30.48,21.59 27.94,24.13 v21.59,24.13 | SV3.1 SV3.2 SV3.3 40.39,25.15 v39.37,24.13 38.1,22.86 38.1,21.59 33.02,16.51 33.02,2.54 33.4,2.16 61.98,2.16 62.74,2.92 | 25.4,54.61 27.43,56.64 R7.2 28.77,61.79 30.48,63.5 32.32,63.5 R15.2 32.58,61.91 v33.66,60.83 | X3-CZUJNIKI.1 91.82,5.97 92.71,5.08 92.71,2.79 92.08,2.16 63.5,2.16 62.74,2.92 | 59.06,39.37 L1.1 59.31,39.37 68.58,39.37 69.85,40.64 | X2-LCD_STER.7 62.87,3.05 62.74,2.92 | JP1.2 JP1.4 51.94,81.92 55.63,81.92 57.53,83.82 62.23,83.82 63.12,84.71 63.12,89.79 64.77,91.44 v66.04,91.44 64.52,92.96 60.33,92.96 59.56,93.72 58.67,93.72 DUST1.1 | 69.85,40.64 71.75,42.55 | 71.75,42.55 v78.74,49.53 | U2.8 43.68,77.22 v42.29,78.61 | R1.2 72.39,41.91 71.75,42.55 | v69.72,92.08 78.11,92.08 78.74,92.71 78.74,96.4 WIATR1.4 | v71.75,39.5 70.99,39.5 69.85,40.64 | v60.2,37.08 60.96,37.08 | 60.96,37.08 v69.72,37.08 | 60.96,37.08 61.34,36.7 61.34,35.31 63.5,33.15
  Top 0.61: 59.06,39.37 54.36,39.37 49.66,44.07 47.94,44.07 | v33.02,24.13 33.02,21.08 32.77,20.83 31.82,20.83 R26.2 | 23.18,50.55 23.18,42.5 C6.+ | 47.94,44.07 C16.2 | 47.94,44.07 v45.21,44.07 45.02,43.88 C18.2
  Top 0.813: C17.2 42.35,45.53 v42.29,45.47
  Bottom 0.406: IC1.TAB 20.32,41.35 20.32,40.64 22.67,38.29 R8.1 22.67,29.84 | 22.67,29.84 22.67,24.13 | 22.67,24.13 22.67,8.7 19.05,5.08 KANDA.2 | v21.59,24.13 22.67,24.13 | v39.37,24.13 v33.02,24.13 | IC5.5 63.63,90.3 64.77,91.44 v66.04,91.44 69.09,91.44 v69.72,92.08 | C9.1 87.19,49.09 86.36,48.26 83.47,48.26 IC2.2 79.88,48.39 v78.74,49.53 | R24.2 22.67,29.84 | JP1.2 45.72,82.04 v42.29,78.61 41.91,78.23 41.91,76.2 43.18,74.93 43.18,72.39 44.45,71.12 44.45,69.85 35.43,60.83 v33.66,60.83 | R57.1 73.15,38.1 v71.75,39.5 69.72,37.47 v69.72,37.08 | R19.1 60.58,32.38 59.82,33.15 59.82,36.7 v60.2,37.08
  Bottom 0.61: 44.2,44.7 43.5,44.01 43.18,43.69 41.15,43.69 40.89,43.94 39.79,43.94 IC3.5 39.68,43.94 31.05,43.94 C4.2 24.95,44 24.13,43.18 24.13,41.55 C6.+ | 44.2,44.7 45.59,46.1 45.59,50.54 IC3.17 | 44.2,44.7 44.83,44.07 v45.21,44.07 46.33,42.95 IC3.38
  Bottom 0.813: IC1.TAB 23.01,41.4 C6.+ | v42.29,45.47 42.29,45.21 43.5,44.01
  Bottom 1.016: IC1.2 IC1.TAB
+9V
  Bottom 0.813: X1.2 5.8,37.47 4.45,37.47 2.03,35.05 2.03,22.1 3.2,20.93 U$1.P$1 4,18.37 C3.2 | X1.2 6.81,37.29 7.84,36.26 C2.2 | C2.2 13.68,36.26 C5.+ | IC4.3 11.63,35.68 C2.2 | IC1.3 12.39,43.71 X1.2
DEBUG1
  Bottom 0.406: X3-CZUJNIKI.7 84.2,14.86 75.56,23.5 | 75.56,23.5 64.77,34.29 64.77,43.18 54.61,53.34 49.66,53.34 48.9,52.58 48.9,50.76 IC3.21 | R18.1 73.66,21.59 75.56,23.5
DEBUG2  (via drill 0.6)
  Top 0.406: X3-CZUJNIKI.8 82.93,9.27 85.09,11.43 85.09,13.97 75.56,23.5 | 75.56,23.5 v63.5,35.56 | R3.1 74.93,22.86 75.56,23.5
  Bottom 0.406: v63.5,35.56 63.5,43.18 54.61,52.07 51.01,52.07 IC3.22
DUST_AOUT  (via drill 0.6)
  Top 0.406: v48.01,48.26 48.01,56.9 v54.61,63.5
  Bottom 0.406: IC3.36 47.93,48.19 v48.01,48.26 | v54.61,63.5 54.61,83.82 52.07,86.36 52.07,91.57 JP2.1
DUST_ILED  (via drill 0.6)
  Top 0.406: DUST1.4 64.51,96.78 68.58,92.71 v68.58,83.82 | v36.83,58.93 39.37,58.93 45.59,53.34 45.59,46.1 43.69,44.2 42.93,44.2 41.91,43.18 v41.91,42.29 | v52.07,73.66 v57.15,78.74
  Bottom 0.406: v68.58,83.82 66.04,81.28 59.69,81.28 v57.15,78.74 | v36.83,58.93 36.83,59.69 45.72,68.58 46.99,68.58 v52.07,73.66 | v41.91,42.29 41.91,42.16 41.53,41.78 IC3.44
GND  (via drill 0.6)
  other vias: 39.12,66.8 51.05,55.88 31.75,22.86 35.56,8.89 24.38,61.47 60.58,85.85 43.43,57.15 40.64,29.21 40.39,36.96 26.67,12.7 78.49,33.15 75.95,19.18 92.46,35.69 96.27,77.6 59.44,75.06 7.49,60.96 20.57,56.39 19.3,47.5
  pour Bottom: 0,0 99.06,0 99.06,99.06 0,99.06
  pour Top: 0,0 99.06,0 99.06,99.06 0,99.06
INT0  (via drill 0.6)
  Top 0.406: v34.8,56.52 34.8,58.93 v36.83,60.96 | WIATR1.2 | v50.8,74.93 v57.15,81.28
  Bottom 0.406: v36.83,60.96 v50.8,74.93 | v57.15,81.28 58.42,82.55 62.8,82.55 C13.2 65.09,82.87 68.58,86.36 68.58,90.17 69.85,90.17 71.12,91.44 71.12,95.25 72.39,96.52 75.56,96.52 WIATR1.2 | IC3.11 36.04,48.8 34.8,50.04 v34.8,56.52
INT1  (via drill 0.6)
  Top 0.406: v52.58,71.63 59.69,78.74 71.12,78.74 77.47,85.09 77.47,88.9 v81.28,92.71 | v39.88,50.67 39.62,50.93 39.62,56.9 v39.37,57.15
  Bottom 0.406: DESZCZ1.2 86.81,96.78 C12.2 85.02,96.45 v81.28,92.71 | v52.58,71.63 48.26,67.31 45.72,67.31 39.37,60.96 v39.37,57.15 | IC3.12 39.95,50.6 v39.88,50.67
INT2  (via drill 0.6)
  Top 0.406: v41.91,35.56 44.45,38.1 76.2,38.1 78.74,40.64 78.74,41.91 | v78.74,45.72 78.74,41.91 | R1.1 78.74,41.91
  Bottom 0.406: v78.74,45.72 80.14,47.12 IC2.3 85.85,47.12 86.3,46.67 R28.1 | v41.91,35.56 43.18,36.83 43.18,38.95 IC3.42
INT_LIGHT  (via drill 0.6)
  Top 0.406: U$7.INT v13.59,81.66
  Bottom 0.406: IC3.16 44.7,50.63 44.7,52.7 41.27,55.75 37.08,55.75 35.05,58.42 33.02,58.42 30.48,60.96 30.48,67.31 16.13,81.66 v13.59,81.66
KIERUNEK_WIATRU  (via drill 0.6)
  Top 0.406: v46.74,47.62 46.74,58.17 v55.88,67.31
  Bottom 0.406: IC3.37 47.13,47.23 v46.74,47.62 | v55.88,67.31 74.55,85.98 74.55,90.17 | 74.55,90.17 WIATR1.1 | R2.2 74.99,90.61 74.55,90.17
LCD_D4
  Bottom 0.406: X2-LCD.1 49.4,6.1 50.04,5.46 50.04,3.56 48.64,2.16 33.4,2.16 33.02,2.54 33.02,16.51 38.1,21.59 41.91,21.59 46.99,26.67 46.99,29.34 48.77,31.11 48.77,38.96 IC3.35
LCD_D5  (via drill 0.6)
  Top 0.406: v48.26,24.89 v48.26,28.45
  Bottom 0.406: X2-LCD.2 48.13,24.77 v48.26,24.89 | v48.26,28.45 48.26,29.08 49.53,30.35 IC3.34
LCD_D6
  Bottom 0.406: X2-LCD.3 46.86,25.27 52.07,30.48 52.07,40.06 IC3.33
LCD_D7  (via drill 0.6)
  Top 0.406: v45.47,22.61 45.72,22.86 48.01,22.86 v50.16,25.02
  Bottom 0.406: v45.47,22.61 45.47,4.19 X2-LCD.4 | IC3.32 51.39,41.66 52.32,41.66 52.96,41.27 52.96,29.34 50.16,26.29 v50.16,25.02
LCD_E  (via drill 0.6)
  Top 0.406: X2-LCD.7 41.78,9.53 50.67,18.41 50.67,20.19 v52.83,22.35
  Bottom 0.406: IC3.24 51.34,48.01 57.02,48.01 57.4,47.62 57.4,27.56 52.83,22.99 v52.83,22.35
LCD_LIGTH  (via drill 0.6)
  Top 0.406: v55.88,46.99 55.88,47.24 v53.98,49.15 | v41.91,11.43 44.45,13.97 44.45,16.51 v50.8,22.86
  Bottom 0.406: X2-LCD.8 40.51,5.21 39.37,6.35 39.37,7.62 41.91,10.16 v41.91,11.43 | v55.88,46.99 55.88,27.94 v50.8,22.86 | IC3.23 51.36,48.77 51.36,48.82 52.07,49.53 53.59,49.53 v53.98,49.15
LCD_RS  (via drill 0.6)
  Top 0.406: X2-LCD.5 44.32,10.79 v54.23,20.7 | v59.05,44.96 58.42,45.59 54.48,45.59 v53.98,46.1
  Bottom 0.406: v54.23,20.7 54.23,22.86 58.93,27.56 58.93,44.83 v59.05,44.96 | v53.98,46.1 53.34,46.1 53.09,46.35 51.38,46.35 IC3.26
LCD_RW  (via drill 0.6)
  Top 0.406: v43.18,16.51 v52.07,25.4
  Bottom 0.406: IC3.25 51.38,47.24 54.48,47.24 54.99,46.74 54.99,28.45 52.07,25.53 v52.07,25.4 | X2-LCD.6 43.05,16.38 v43.18,16.51
LCD_S1  (via drill 0.6)
  Top 0.406: X2-LCD_STER.1 70.48,8.26 68.58,10.16 68.58,17.78 v50.8,35.56 | v50.8,38.99 50.42,39.37 39.88,39.37 38.61,40.64 38.61,47.75 36.83,49.53 36.83,50.67 v37.59,51.44
  Bottom 0.406: v50.8,35.56 v50.8,38.99 | IC3.13 42.29,50.64 42.29,51.44 41.15,52.58 38.86,52.58 38.73,52.45 38.61,52.32 37.72,51.44 v37.59,51.44
LCD_S2  (via drill 0.6)
  Top 0.406: v58.42,25.4 48.64,35.18 46.35,35.18 43.81,32.64 v41.27,32.64 | v37.85,37.08 37.85,46.61 35.81,48.64 35.81,52.83 36.07,53.09 v37.85,53.09
  Bottom 0.406: X2-LCD_STER.2 69.22,14.61 v58.42,25.4 | v41.27,32.64 39.88,32.64 37.85,34.67 v37.85,37.08 | IC3.14 43.13,51.61 40.77,53.98 38.86,53.98 v37.85,53.09
LCD_S3  (via drill 0.6)
  Top 0.406: X2-LCD_STER.3 67.94,6.99 66.04,8.89 66.04,16.38 48.01,34.42 46.74,34.42 43.94,31.62 v39.62,31.62 | v36.96,33.91 36.96,45.97 34.92,48.01 34.92,53.47 35.94,54.48 v36.96,54.48
  Bottom 0.406: v39.62,31.62 39.24,31.62 v36.96,33.91 | IC3.15 43.93,51.95 41.15,54.74 37.21,54.74 v36.96,54.48
LCD_S4  (via drill 0.6)
  Top 0.406: v47.24,33.27 v57.66,22.86
  Bottom 0.406: IC3.40 44.73,35.78 v47.24,33.27 | v57.66,22.86 66.67,13.84 X2-LCD_STER.4
LCD_S5  (via drill 0.6)
  Top 0.406: v46.99,31.75 v55.88,22.86
  Bottom 0.406: IC3.41 43.93,34.81 v46.99,31.75 | v55.88,22.86 65.41,13.34 X2-LCD_STER.5
MCP3421-VIN  (via drill 0.6)
  Top 0.406: JP2.3 53.72,97.41 55.12,96.65 v55.12,92.84
  Bottom 0.406: IC5.1 58.86,89.41 57.53,89.41 56.52,90.42 56.13,90.42 55.12,91.44 v55.12,92.84
MISO  (via drill 0.6)
  Top 0.406: v26.67,16.51 26.54,16.51 26.16,16.13 15.88,16.13 KANDA.9
  Bottom 0.406: v26.67,16.51 26.67,22.86 31.62,27.81 31.62,34.54 38.68,41.6 IC3.2
MOSI  (via drill 0.6)
  Top 0.406: v27.94,21.59 21.59,21.59 v20.32,20.32
  Bottom 0.406: v27.94,21.59 33.02,26.67 33.02,34.29 39.53,40.8 IC3.1 | v20.32,20.32 20.32,10.41 KANDA.1
N$1  (via drill 0.6)
  Top 0.406: R9.2 16.6,65.21 T1.2 15.86,63.5 15.24,63.5 15.24,62.23 14.48,61.47 v10.92,61.47
  Bottom 0.406: U$2.5 8.21,58.76 v10.92,61.47
N$2  (via drill 0.6)
  Top 0.406: v53.09,45.09 54.1,44.07 55.94,44.07 C11.2 57.6,43.88 L1.2
  Bottom 0.406: IC3.27 52.57,45.6 v53.09,45.09
N$3  (via drill 0.6)
  Top 0.406: v53.98,43.18 50.8,45.72 50.8,48.26 52.07,49.53 52.07,50.99 C1.2
  Bottom 0.406: IC3.29 52.52,44 v53.98,43.18
N$4
  Top 0.406: R3.2 69.36,22.86 Q2.1
N$5  (via drill 0.6)
  Top 0.406: LED4.A 21.84,61.72 v22.35,61.21
  Bottom 0.406: v22.35,61.21 22.35,60.45 20.83,58.93 R25.2
N$6  (via drill 0.6)
  Top 0.406: v17.27,67.31 17.27,66.44 T1.1
  Bottom 0.406: R6.2 v17.27,67.31
N$7
  Bottom 0.406: IC2.14 76.33,47.12 77.47,48.26 77.47,55.88 BAT1.+
N$8  (via drill 0.6)
  Top 0.406: LED4.C 19.59,66.52 v19.56,66.55
  Bottom 0.406: v19.56,66.55 7.62,54.61 7.62,49.66 6.73,48.77 U$2.10
N$9
  Top 0.406: U$2.6 9.73,56.76 R12.2 10.99,56.71 12.7,58.42 12.7,58.82 T2.2
N$10  (via drill 0.6)
  Top 0.406: v35.81,45.47 35.12,45.47 C7.2 31.43,46.74 Q1.2
  Bottom 0.406: IC3.7 35.95,45.6 v35.81,45.47
N$11  (via drill 0.6)
  Top 0.406: Q1.1 32.51,56.39 v33.02,55.88 33.02,46.99 33.66,46.35 v33.78,46.35
  Bottom 0.406: v33.02,55.88 C8.2 | IC3.8 33.82,46.4 v33.78,46.35
N$12  (via drill 0.6)
  Top 0.406: v26.67,37.47 26.67,35.19 LED2.A
  Bottom 0.406: R8.2 26.54,37.59 v26.67,37.47
N$16
  Bottom 0.406: JP2.2 54.99,94.87 57.15,92.71 59.69,92.71 DUST1.3
N$17
  Top 0.406: Q2.3 67.1,26.46 LED1.K
N$21
  Top 0.406: LED1.A 66.04,29.21 63.5,31.75 63.43,31.75 R4.2
N$22
  Top 0.406: T2.1 14.41,58.61 16.51,56.52 18.22,56.52 R11.2
N$23
  Bottom 0.406: R18.2 69.61,22.86 Q3.1
N$24
  Bottom 0.406: Q3.3 66.84,24.59 LED3.K
N$25
  Top 0.406: T3.1 27.24,69.28 25.4,71.12 25.4,71.95 R13.1
N$26  (1 unrouted)
N$27
  Top 0.406: T4.1 35.75,74.17 R16.1
N$32  (via drill 0.6)
  Top 0.406: U2.2 v45.09,73.79
  Bottom 0.406: v45.09,73.79 46.35,75.06 47.37,75.06 JP1.3
N$33
  Top 0.406: JP1.1 49.28,75.95 48.9,75.95 46.35,73.41 U2.3
N$37
  Bottom 0.406: Q13.1 87.44,44.58 R28.2
N$45
  Bottom 0.406: Q13.3 93.01,40.43 LED15.K
N$75
  Bottom 0.406: LED15.A 88.71,38.23 R57.2
RST  (via drill 0.6)
  Top 0.406: v24.13,12.7 24.13,12.57 23.62,12.06 16.89,12.06 KANDA.5
  Bottom 0.406: 29.21,27.94 24.13,22.86 v24.13,12.7 | IC3.4 37.48,43.2 29.21,34.92 29.21,27.94 | R24.1 29.21,27.94
RX  (via drill 0.6)
  Top 0.406: T2.3 14.94,56.81 16.51,55.24 20.38,55.24 21.3,54.32 | 21.3,54.32 R10.2 | v23.62,54.61 21.59,54.61 21.3,54.32
  Bottom 0.406: IC3.9 26.46,47.2 25.4,48.26 25.4,52.83 v23.62,54.61
SCK  (via drill 0.6)
  Top 0.406: v25.4,14.86 24.77,14.22 23.88,14.22 23.24,13.59 15.88,13.59 KANDA.7
  Bottom 0.406: v25.4,14.86 25.4,22.86 30.48,27.94 30.48,34.8 38.08,42.4 IC3.3
SCL-3.3V  (via drill 0.6)
  Top 0.406: U$3.SCL 8.13,84.58 8.89,83.82 19.05,83.82 20.32,85.09 20.32,86.36 U$5.SCL 20.57,87.88 21.59,88.9 31.75,88.9 33.02,87.63 U$6.SCL 33.02,76.2 31.56,74.74 R17.1 33.85,71.88 T4.2 31.75,69.36 v31.75,68.58 | v41.91,68.58 v48.26,62.23
  Bottom 0.406: U$7.SCL 3.43,76.58 2.54,77.47 2.54,82.55 3.81,83.82 7.37,83.82 8.13,84.58 U$3.SCL | X3-CZUJNIKI.5 86.74,13.59 66.04,34.29 66.04,44.45 v48.26,62.23 | v41.91,68.58 v31.75,68.58
SCL-5V  (via drill 0.6)
  Top 0.406: v43.18,62.23 41.83,62.23 T4.3 35.39,69.85 v38.1,69.85 | v40.64,59.69 36.83,63.5 34.73,63.5 R15.1 | v40.64,69.85 40.64,73.66 42.8,75.82 46.1,75.82 46.35,76.07 U2.6 46.35,84.33 53.34,91.31 v57.15,91.31
  Bottom 0.406: IC3.19 47.13,58.28 45.72,59.69 | 45.72,59.69 v43.18,62.23 46.99,66.04 50.8,66.04 67.18,49.66 IC2.16 | v40.64,59.69 45.72,59.69 | v40.64,69.85 v38.1,69.85 | IC5.3 57.22,91.25 v57.15,91.31
SDA-3.3V  (via drill 0.6)
  Top 0.406: T3.2 25.33,67.38 13.97,78.74 5.33,78.74 U$7.SDA | X3-CZUJNIKI.4 88.01,12.32 67.31,33.02 v67.31,35.56 | v49.53,63.5 v41.91,71.12
  Bottom 0.406: 10.67,83.82 U$3.SDA 10.67,90.87 R14.1 | 10.67,83.82 10.67,79.25 10.16,78.74 5.33,78.74 U$7.SDA | U$5.SDA 23.11,85.34 | 23.11,85.34 21.59,83.82 10.67,83.82 | U$6.SDA 35.56,85.09 | 35.56,85.09 34.29,83.82 24.64,83.82 23.11,85.34 | v67.31,35.56 67.31,45.72 v49.53,63.5 | v41.91,71.12 41.27,71.12 40.64,71.75 40.64,80.01 35.56,85.09
SDA-5V  (via drill 0.6)
  Top 0.406: R7.1 28.13,63.69 30.48,66.04 | 30.48,66.04 30.48,67.39 T3.3 | 30.48,66.04 35.56,66.04 40.64,60.96 v46.99,60.96 39.37,68.58 39.37,82.17 v41.4,84.2 | 52.2,84.2 56.26,84.2 59.69,87.63 59.69,88.27 v63.25,91.82 | 52.2,84.2 48.26,84.2 47.62,83.57 U2.5 | v50.16,85.6 50.8,85.6 52.2,84.2
  Bottom 0.406: IC3.20 47.93,60.02 v46.99,60.96 46.99,63.5 48.26,64.77 50.8,64.77 67.18,48.39 IC2.15 | IC5.4 62.67,91.25 v63.25,91.82 | v41.4,84.2 48.77,84.2 v50.16,85.6
TX  (via drill 0.6)
  Top 0.406: T1.3 18.46,60.96 20.32,60.96 22.67,58.61 R5.2 23.56,58.42 24.13,58.42 25.4,57.15 v25.4,56.52
  Bottom 0.406: IC3.10 26.93,48 26.67,48.26 26.67,55.24 v25.4,56.52

### Text on the board
tPlace: 1 - AVR / 2 - DUST / 3 - MCP3421 | + 5V | + 5V | Adres EEPROM / 1 i 2 EEPROM / 3 i 4 +5V | Meteo v 1.1 / / VIII 2018 | RTC INT | RTC | +9V | GND | power | power | MISO | SCK | RST | MOSI | GND | GND | +5V
tNames: DEBUG2 | DEBUG1